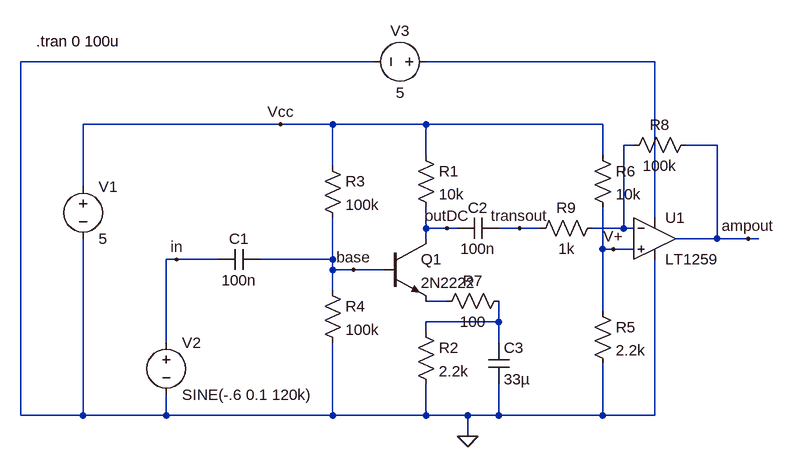
[diagram p0: schematic laserAmpOpAmp1259.asc]
laserAmpOpAmp1259.asc, the LTspice schematic file:
Version 4
SHEET 1 880 680
WIRE 160 0 -384 0
WIRE 592 0 240 0
WIRE 16 96 -288 96
WIRE 96 96 16 96
WIRE 240 96 96 96
WIRE 512 96 240 96
WIRE 560 128 544 128
WIRE 688 128 640 128
WIRE 240 144 240 96
WIRE 512 144 512 96
WIRE 96 160 96 96
WIRE -288 192 -288 96
WIRE 592 240 592 0
WIRE 240 256 240 224
WIRE 272 256 240 256
WIRE 288 256 272 256
WIRE 384 256 352 256
WIRE 416 256 384 256
WIRE 544 256 544 128
WIRE 544 256 496 256
WIRE 560 256 544 256
WIRE 240 272 240 256
WIRE 688 272 688 128
WIRE 688 272 624 272
WIRE 736 272 688 272
WIRE 752 272 736 272
WIRE 512 288 512 224
WIRE 528 288 512 288
WIRE 560 288 528 288
WIRE -144 304 -160 304
WIRE -80 304 -144 304
WIRE 96 304 96 240
WIRE 96 304 -16 304
WIRE 96 320 96 304
WIRE 128 320 96 320
WIRE 176 320 128 320
WIRE 96 352 96 320
WIRE 272 368 240 368
WIRE 512 384 512 288
WIRE 352 400 352 368
WIRE 352 400 240 400
WIRE 240 416 240 400
WIRE -160 432 -160 304
WIRE 352 432 352 400
WIRE -384 544 -384 0
WIRE -288 544 -288 272
WIRE -288 544 -384 544
WIRE -160 544 -160 512
WIRE -160 544 -288 544
WIRE 96 544 96 432
WIRE 96 544 -160 544
WIRE 240 544 240 496
WIRE 240 544 96 544
WIRE 304 544 240 544
WIRE 352 544 352 496
WIRE 352 544 304 544
WIRE 512 544 512 464
WIRE 512 544 352 544
WIRE 592 544 592 304
WIRE 592 544 512 544
WIRE 304 576 304 544
FLAG 304 576 0
FLAG -144 304 in
FLAG 272 256 outDC
FLAG 384 256 transout
FLAG 16 96 Vcc
FLAG 128 320 base
FLAG 736 272 ampout
FLAG 528 288 V+
SYMBOL npn 176 272 R0
SYMATTR InstName Q1
SYMATTR Value 2N2222
SYMBOL res 224 128 R0
SYMATTR InstName R1
SYMATTR Value 10k
SYMBOL res 224 400 R0
SYMATTR InstName R2
SYMATTR Value 2.2k
SYMBOL res 80 144 R0
SYMATTR InstName R3
SYMATTR Value 100k
SYMBOL res 80 336 R0
SYMATTR InstName R4
SYMATTR Value 100k
SYMBOL voltage -288 176 R0
SYMATTR InstName V1
SYMATTR Value 5
SYMBOL voltage -160 416 R0
SYMATTR Value2 AC .
SYMATTR InstName V2
SYMATTR Value SINE(-.6 0.1 120k)
SYMBOL cap -16 320 M270
WINDOW 0 32 32 VTop 2
WINDOW 3 0 32 VBottom 2
SYMATTR InstName C1
SYMATTR Value 100n
SYMBOL cap 352 272 M270
WINDOW 0 32 32 VTop 2
WINDOW 3 0 32 VBottom 2
SYMATTR InstName C2
SYMATTR Value 100n
SYMBOL cap 336 432 R0
SYMATTR InstName C3
SYMATTR Value 33µ
SYMBOL voltage 256 0 R90
WINDOW 0 -32 56 VBottom 2
WINDOW 3 32 56 VTop 2
SYMATTR InstName V3
SYMATTR Value 5
SYMBOL res 496 368 R0
SYMATTR InstName R5
SYMATTR Value 2.2k
SYMBOL Opamps/LT1259 592 208 R0
SYMATTR InstName U1
SYMBOL res 496 128 R0
SYMATTR InstName R6
SYMATTR Value 10k
SYMBOL res 368 352 R90
WINDOW 0 0 56 VBottom 2
WINDOW 3 32 56 VTop 2
SYMATTR InstName R7
SYMATTR Value 100
SYMBOL res 656 112 R90
WINDOW 0 0 56 VBottom 2
WINDOW 3 32 56 VTop 2
SYMATTR InstName R8
SYMATTR Value 100k
SYMBOL res 512 240 R90
WINDOW 0 0 56 VBottom 2
WINDOW 3 32 56 VTop 2
SYMATTR InstName R9
SYMATTR Value 1k
TEXT -360 -32 Left 2 !.tran 0 100u

The netlist it stands for:
* laserAmpOpAmp1259.asc
Q1 outDC base N003 0 2N2222
R1 Vcc outDC 10k
R2 N004 0 2.2k
R3 Vcc base 100k
R4 base 0 100k
V1 Vcc 0 5
V2 in 0 SINE(-.6 0.1 120k) AC .
C1 base in 100n
C2 transout outDC 100n
C3 N004 0 33µ
V3 N001 0 5
R5 V+ 0 2.2k
XU1 V+ N002 N001 0 ampout LT1259  ; pins In+ In- V+ V- OUT
R6 Vcc V+ 10k
R7 N004 N003 100
R8 ampout N002 100k
R9 N002 transout 1k
.model NPN NPN
.model PNP PNP
.lib standard.bjt
.tran 0 100u
.backanno
.end